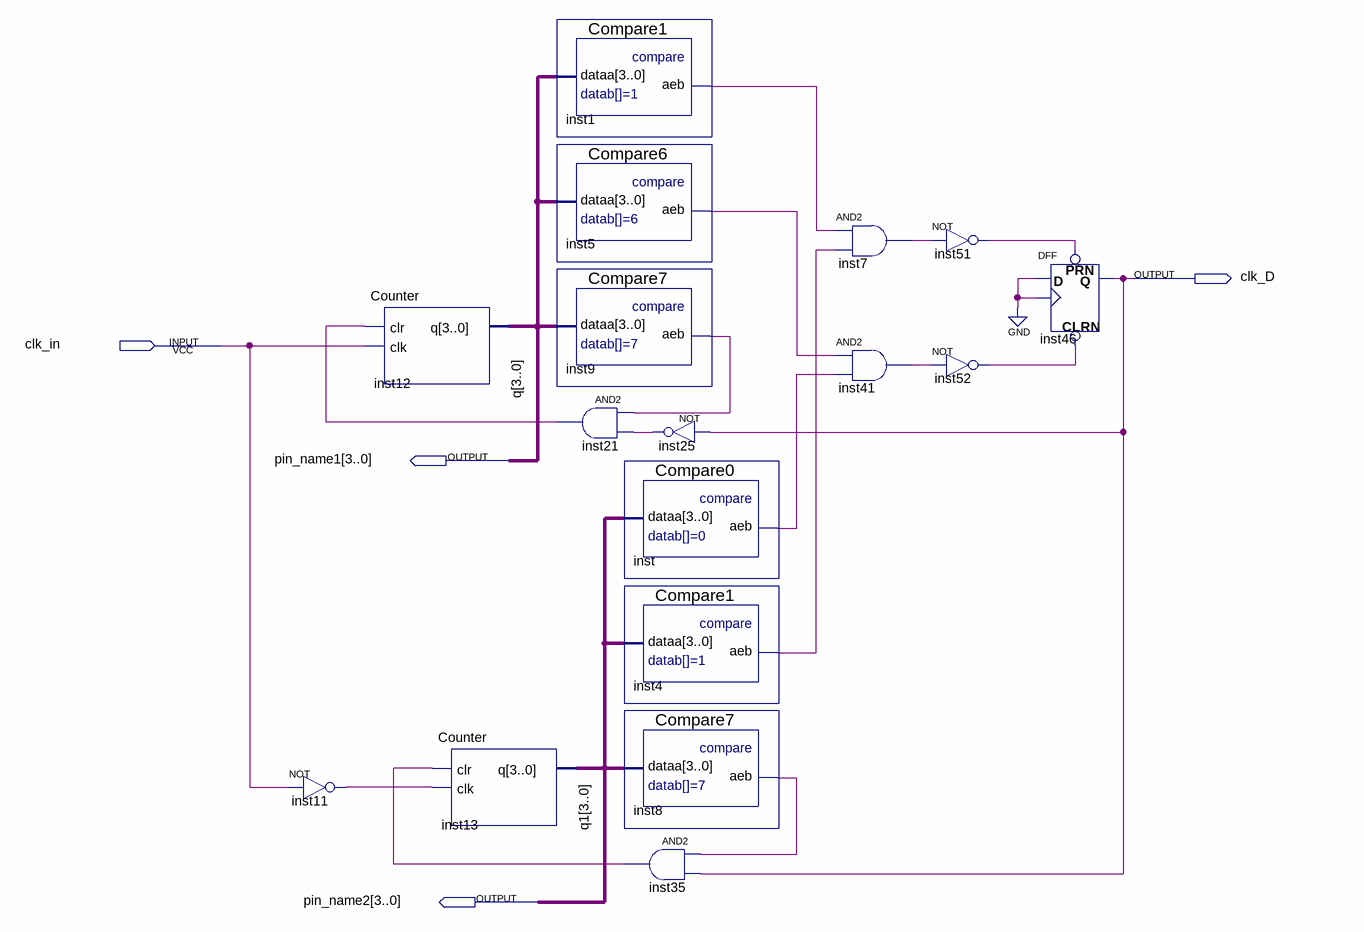
[diagram p0: schematic sheet]
// Quartus schematic Block2.bdf as structural Verilog: 17 symbols, 4 pins
module Block2 (
  input  clk_in,
  output clk_D,
  output [3:0] pin_name1,
  output [3:0] pin_name2
);

  wire inst1_aeb, inst4_aeb, inst5_aeb, inst7_out, inst8_aeb, inst9_aeb, inst11_out, inst21_out, inst25_out,
       inst35_out, inst41_out, inst51_out, inst52_out, inst_aeb;

  not inst11 (inst11_out, clk_in);
  Counter inst12 (.clr(inst21_out), .clk(clk_in), .q(pin_name1));
  Counter inst13 (.clr(inst35_out), .clk(inst11_out), .q(pin_name2));
  Compare1 inst1 (.dataa(pin_name1), .aeb(inst1_aeb));
  Compare6 inst5 (.dataa(pin_name1), .aeb(inst5_aeb));
  Compare7 inst9 (.dataa(pin_name1), .aeb(inst9_aeb));
  and inst21 (inst21_out, inst9_aeb, inst25_out);
  not inst25 (inst25_out, clk_D);
  Compare0 inst (.dataa(pin_name2), .aeb(inst_aeb));
  Compare1 inst4 (.dataa(pin_name2), .aeb(inst4_aeb));
  Compare7 inst8 (.dataa(pin_name2), .aeb(inst8_aeb));
  and inst35 (inst35_out, inst8_aeb, clk_D);
  and inst7 (inst7_out, inst1_aeb, inst4_aeb);
  and inst41 (inst41_out, inst5_aeb, inst_aeb);
  not inst51 (inst51_out, inst7_out);
  not inst52 (inst52_out, inst41_out);
  DFF inst46 (.CLRN(inst52_out), .CLK(1'b0), .D(1'b0), .PRN(inst51_out), .Q(clk_D));

  // Other names for the same wires on the sheet: q[3:0] = pin_name1; q1[3:0] = pin_name2
endmodule
